# Altium project LacewingPXE_v3p1.PrjPcb
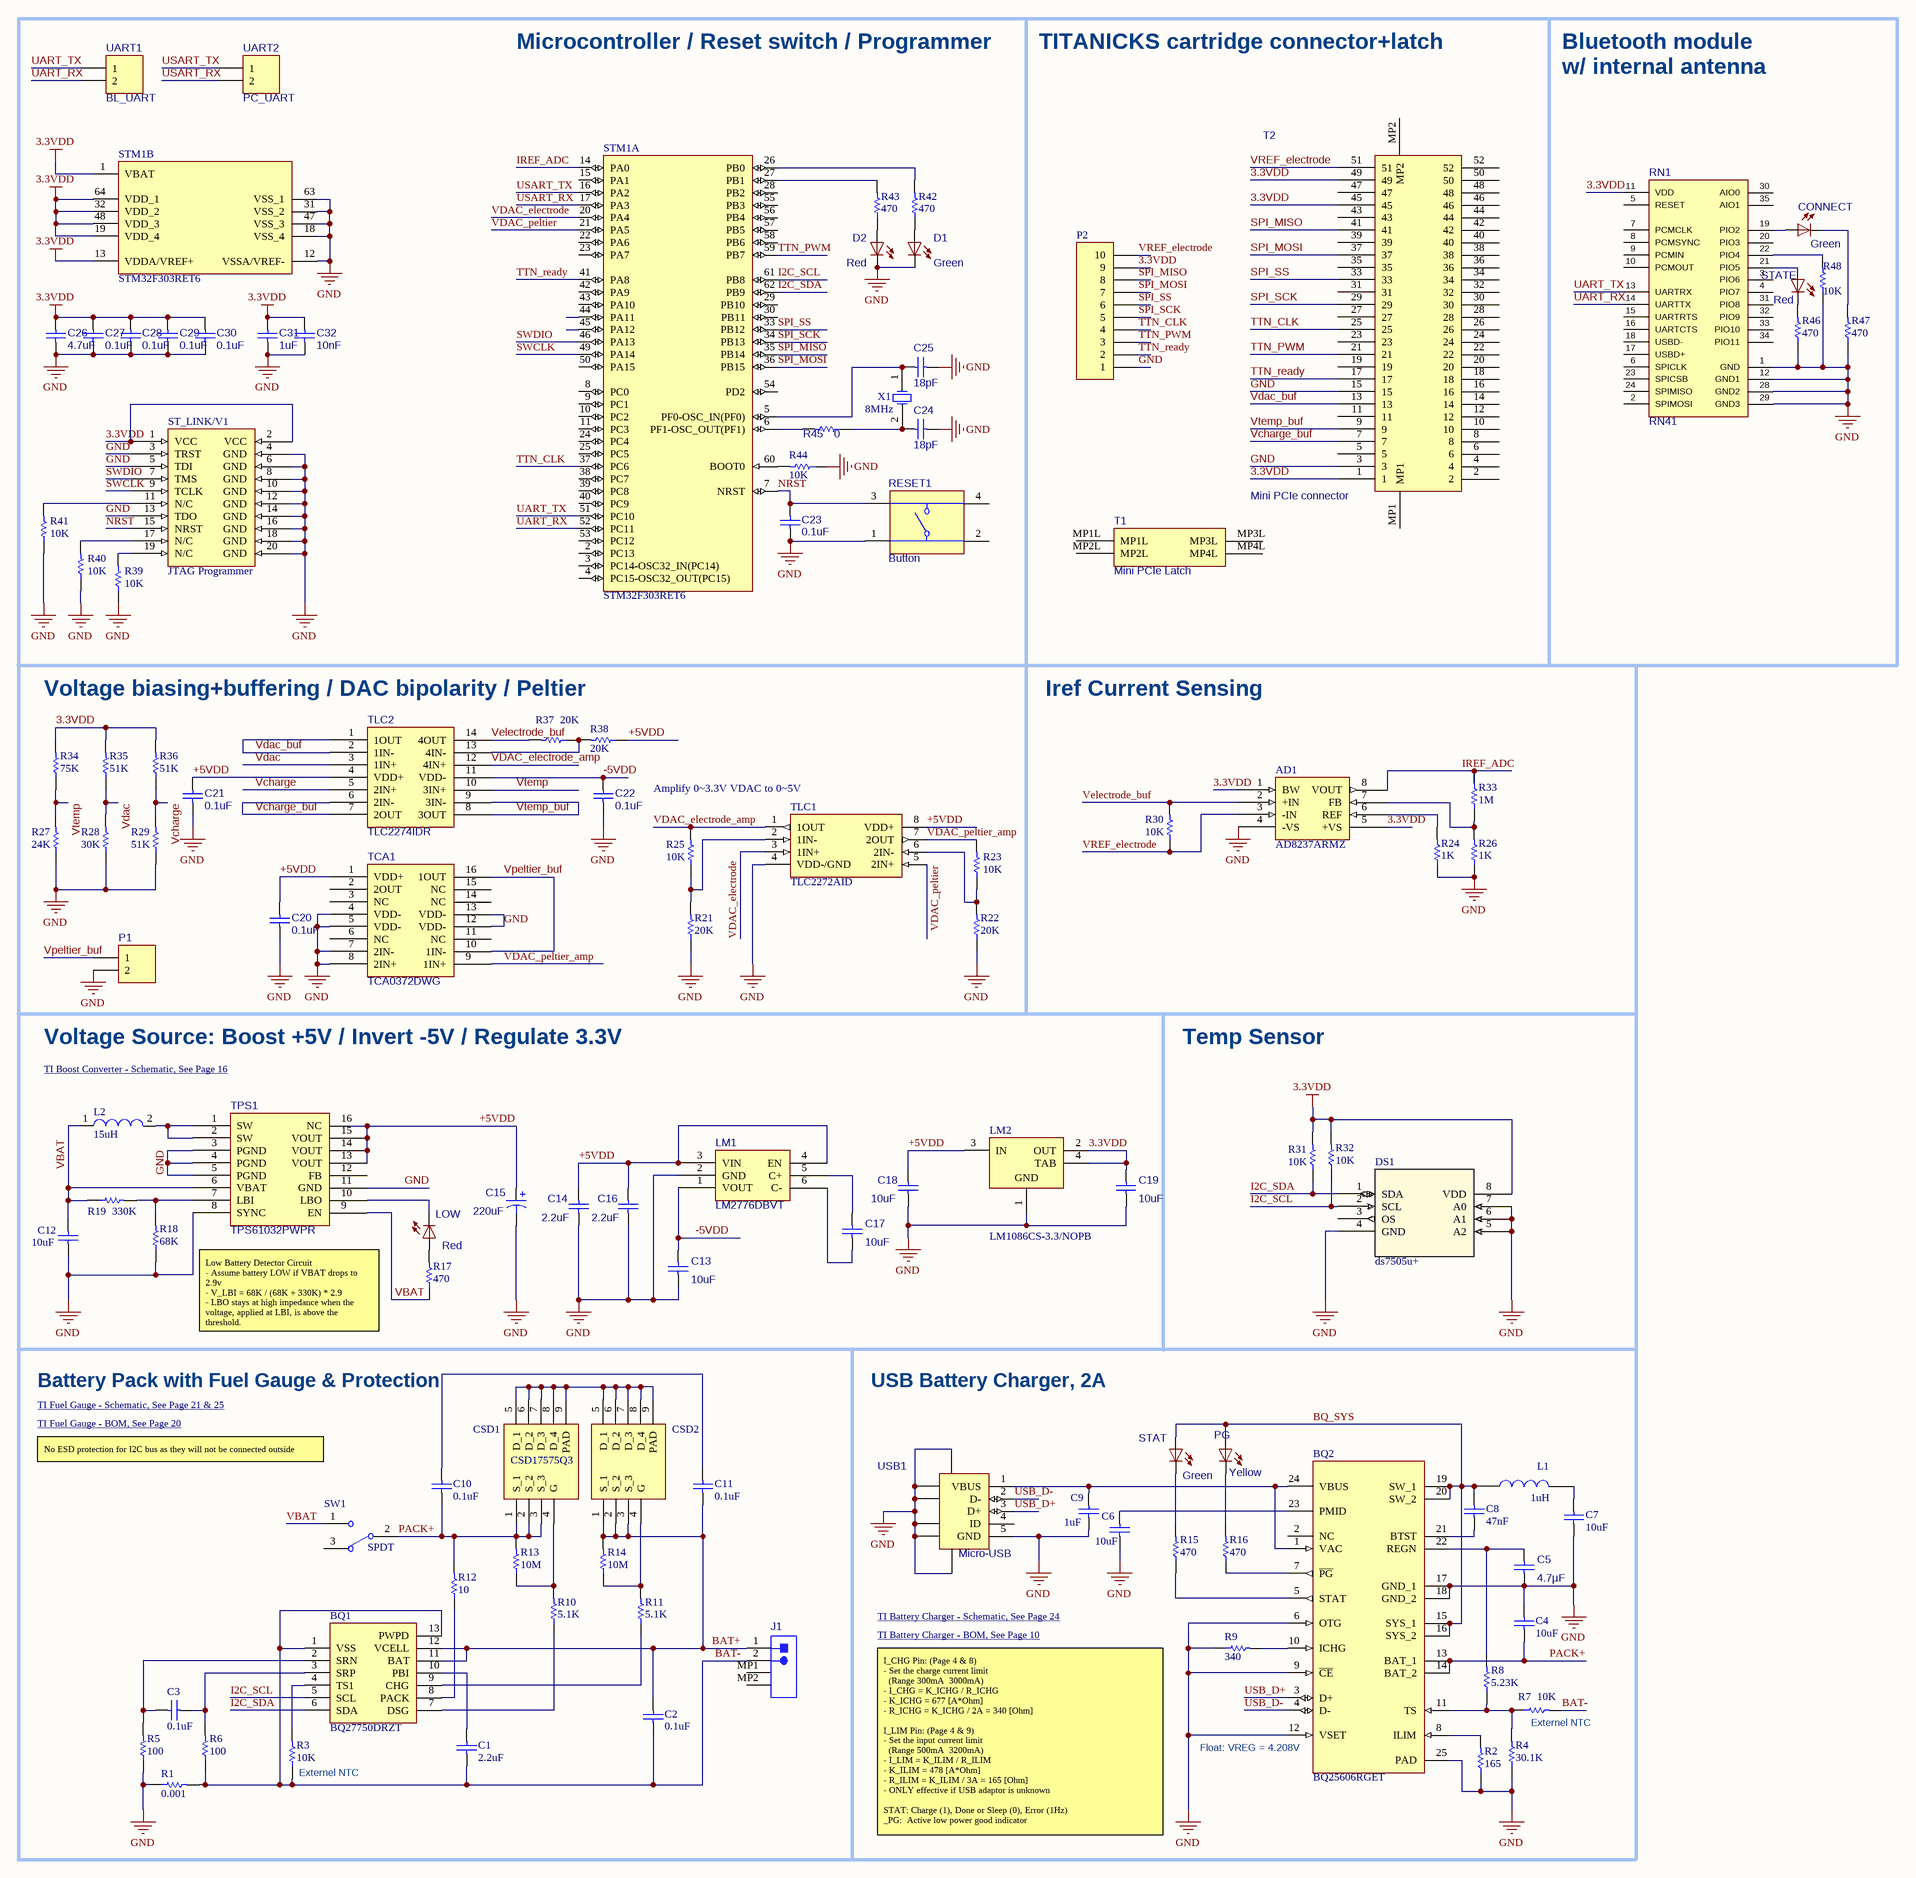
[diagram p0: LacewingPXE_v3p1.SchDoc]
1 sheet, 114 parts. Net scope: global (net labels, ports and power ports of the same name join across sheets).
Board file: LacewingPXE_v3p1.PcbDoc

## Sheet LacewingPXE_v3p1.SchDoc
size A2

### Parts
AD1  AD8237ARMZ  [ADI-RM-8_N]
BQ1  BQ27750DRZT  [BQ27510DRZT]
BQ2  BQ25606RGET  [QFN50P400X400X100-25N]
C1  2.2uF  [CAPC1005X55X25NL05T10]
C2  0.1uF  [CAPC1005X56X25LL10T15]
C3  0.1uF  [CAPC1005X56X25LL10T15]
C4  10uF  [CAPC2013X140X50ML20T25]
C5  4.7µF  [CAPC0603(1608)100_N]
C6  10uF  [CAPC2013X95X45NL10T25]
C7  10uF  [CAPC2013X140X50ML20T25]
C8  47nF  [CAPC1005X55X25NL05T10]
C9  1uF  [CAPC2013X95X45NL10T25]
C10  0.1uF  [CAPC1005X56X25LL10T15]
C11  0.1uF  [CAPC1005X56X25LL10T15]
C12  10uF  [CAPC2013X140X50NL20T25]
C13  10uF  [CAPC0805(2012)75_N]
C14  2.2uF  [CAPC0805(2012)75_N]
C15  220uF  [AVX-CAPC7343_V]
C16  2.2uF  [CAPC0805(2012)75_N]
C17  10uF  [CAPC0805(2012)75_N]
C18  10uF  [CAPC0805(2012)75_N]
C19  10uF  [CAPC0805(2012)75_N]
C20  0.1uF  [CAPC0603(1608)100_N]
C21  0.1uF  [CAPC0603(1608)100_N]
C22  0.1uF  [CAPC0603(1608)100_N]
C23  0.1uF  [CAPC0603(1608)100_N]
C24  18pF  [CAPC0603(1608)100_N]
C25  18pF  [CAPC0603(1608)100_N]
C26  4.7uF  [CAPC0603(1608)100_N]
C27  0.1uF  [CAPC0603(1608)100_N]
C28  0.1uF  [CAPC0603(1608)100_N]
C29  0.1uF  [CAPC0603(1608)100_N]
C30  0.1uF  [CAPC0603(1608)100_N]
C31  1uF  [CAPC0603(1608)100_N]
C32  10nF  [CAPC0603(1608)100_N]
CONNECT  Green  [LED-0603]
CSD1  CSD17575Q3  [CSD16327]
CSD2  CSD17575Q3  [CSD16327]  (value not drawn)
D1  Green  [LED-0603]
D2  Red  [LED-0603]
DS1  ds7505u+  [21-0036K]
J1  (no value)  [JST- S2B-PH-SM4-TB(LF)(SN)-2_V]
L1  1uH  [INDC2520X120N]
L2  15uH  [WE-PD 1050]
LM1  LM2776DBVT  [TI-DBV6_M]
LM2  LM1086CS-3.3/NOPB  [KTT0003B_N]
LOW  Red  [LED-0603]
P1  (no value)  [HDR1X2]
P2  (no value)  [HDR1X10]
PG  Yellow  [LED-0603]
R1  0.001  [RESC3216X89X104LL25T25]
R2  165  [RESC1005X40X25NL05T05]
R3  10K  [RESC1005X40X25LL05T05]
R4  30.1K  [RESC1005X40X25LL05T05]
R5  100  [RESC1005X40X25NL05T05]
R6  100  [RESC1005X40X25NL05T05]
R7  10K  [RESC1005X40X25LL05T05]
R8  5.23K  [RESC1005X40X25LL05T05]
R9  340  [RESC1005X40X25LL05T05]
R10  5.1K  [RESC0402(1005)_N]
R11  5.1K  [RESC0402(1005)_N]
R12  10  [RESC1005X40X25NL05T05]
R13  10M  [RESC1005X40X25LL05T05]
R14  10M  [RESC1005X40X25LL05T05]
R15  470  [RESC1005X40X25LL05T05]
R16  470  [RESC1005X40X25LL05T05]
R17  470  [RESC1005X40X25LL05T05]
R18  68K  [RESC1005X40X25ML05T05]
R19  330K  [RESC1005X40X25NL05T05]
R21  20K  [RESC1005X40X25NL05T05]
R22  20K  [RESC1005X40X25NL05T05]
R23  10K  [RESC1005X40X25NL05T05]
R24  1K  [RESC1005X40X25NL05T05]
R25  10K  [RESC1005X40X25NL05T05]
R26  1K  [RESC1005X40X25NL05T05]
R27  24K  [RESC1005X40X25ML05T05]
R28  30K  [RESC1005X40X25LL05T05]
R29  51K  [RESC1005X40X25ML05T05]
R30  10K  [RESC1005X40X25NL05T05]
R31  10K  [RESC1005X40X25NL05T05]
R32  10K  [RESC1005X40X25NL05T05]
R33  1M  [RESC1005X40X25NL05T05]
R34  75K  [RESC1005X40X25LL05T05]
R35  51K  [RESC1005X40X25ML05T05]
R36  51K  [RESC1005X40X25ML05T05]
R37  20K  [RESC1005X40X25NL05T05]
R38  20K  [RESC1005X40X25NL05T05]
R39  10K  [RESC1005X40X25NL05T05]
R40  10K  [RESC1005X40X25NL05T05]
R41  10K  [RESC1005X40X25NL05T05]
R42  470  [RESC1005X40X25LL05T05]
R43  470  [RESC1005X40X25LL05T05]
R44  10K  [RESC1005X40X25NL05T05]
R45  0  [RESC0603(1608)_N]
R46  470  [RESC1005X40X25LL05T05]
R47  470  [RESC1005X40X25LL05T05]
R48  10K  [RESC1005X40X25NL05T05]
RESET1  Button  [OMRON-B3F-1000-4_V]
RN1  RN41  [RN41]
ST_LINK/V1  JTAG Programmer  [JTAG2]
STAT  Green  [LED-0603]
STATE  Red  [LED-0603]
STM1  STM32F303RET6  [STM-LQFP64_V]  (parts A,B of 2)
SW1  SPDT  [1000-SERIES(SPDT)]
T1  Mini PCIe Latch  [Molex Latch-48099]
T2  Mini PCIe connector  [Molex Conn-67910]
TCA1  TCA0372DWG  [ONSC-SOIC-16-751G-03_V]
TLC1  TLC2272AID  [SOIC127P600X175-8N]
TLC2  TLC2274IDR  [TI-D14_M]
TPS1  TPS61032PWPR  [PW0016A_M]
UART1  BL_UART  [HDR1X2]
UART2  PC_UART  [HDR1X2]
USB1  Micro-USB  [HIRO-ZX62R-B-5P_V]
X1  8MHz  [QCL]

### Blocks framed on the sheet
Microcontroller / Reset switch / Programmer: C23-C32 D1 D2 R39-R45 RESET1 ST_LINK/V1 STM1 UART1 UART2 X1
TITANICKS cartridge connector+latch: P2 T1 T2
Voltage biasing+buffering / DAC bipolarity / Peltier: C20-C22 P1 R21-R23 R25 R27-R29 R34-R38 TCA1 TLC1 TLC2
Iref Current Sensing: AD1 R24 R26 R30 R33
Voltage Source: Boost +5V / Invert -5V / Regulate 3.3V: C12-C19 L2 LM1 LM2 LOW R17-R19 TPS1
Temp Sensor: DS1 R31 R32
Battery Pack with Fuel Gauge & Protection: BQ1 C1-C3 C10 C11 CSD1 CSD2 J1 R1 R3 R5 R6 R10-R14 SW1
USB Battery Charger, 2A: BQ2 C4-C9 L1 PG R2 R4 R7-R9 R15 R16 STAT USB1

### Nets
3.3VDD: AD1.1(BW) AD1.5(+VS) C19.1 C26.1 C27.1 C28.1 C29.1 C30.1 C31.1 C32.1 DS1.8(VDD) LM2.2(OUT) LM2.4(TAB) P2.9 R31.2 R32.2 R34.2 R35.2 R36.2 RN1.11(VDD) ST_LINK/V1.1(VCC) ST_LINK/V1.2(VCC) STM1.1(VBAT) STM1.13(VDDA/VREF+) STM1.19(VDD_4) STM1.32(VDD_2) STM1.48(VDD_3) STM1.64(VDD_1) T2.1 T2.45 T2.49
GND: AD1.4(-VS) BQ2.6(OTG) BQ2.9(~{CE}) BQ2.12(VSET) BQ2.17(GND_1) BQ2.18(GND_2) BQ2.25(PAD) C4.2 C5.1 C6.1 C7.1 C9.1 C12.1 C13.2 C14.1 C15.2 C16.1 C18.2 C19.2 C20.2 C21.2 C22.2 C23.2 C24.2 C25.2 C26.2 C27.2 C28.2 C29.2 C30.2 C31.2 C32.2 D1.C D2.C DS1.4(GND) DS1.5(A2) DS1.6(A1) DS1.7(A0) LM1.2(GND) LM2.1(GND) P1.2 P2.1 R1.1 R2.1 R4.1 R5.1 R9.1 R18.1 R21.1 R22.1 R24.1 R26.1 R27.1 R28.1 R29.1 R39.1 R40.1 R41.1 R44.1 R46.1 R47.1 R48.1 RESET1.1 RN1.1(GND) RN1.12(GND1) RN1.28(GND2) RN1.29(GND3) ST_LINK/V1.3(TRST) ST_LINK/V1.4(GND) ST_LINK/V1.5(TDI) ST_LINK/V1.6(GND) ST_LINK/V1.8(GND) ST_LINK/V1.10(GND) ST_LINK/V1.12(GND) ST_LINK/V1.13(TDO) ST_LINK/V1.14(GND) ST_LINK/V1.16(GND) ST_LINK/V1.18(GND) ST_LINK/V1.20(GND) STM1.12(VSSA/VREF-) STM1.18(VSS_4) STM1.31(VSS_2) STM1.47(VSS_3) STM1.63(VSS_1) T2.3 T2.15 TCA1.4(VDD-) TCA1.5(VDD-) TCA1.7(2IN-) TCA1.8(2IN+) TCA1.12(VDD-) TCA1.13(VDD-) TLC1.4(VDD-/GND) TPS1.3(PGND) TPS1.4(PGND) TPS1.5(PGND) TPS1.8(SYNC) TPS1.11(GND) USB1.5(GND) USB1.6(SHLD) USB1.7(SHLD) USB1.8(SHLD) USB1.9(SHLD) USB1.10(SHLD) USB1.11(SHLD)
+5VDD: C14.2 C15.1 C16.2 C18.1 C20.1 C21.1 LM1.3(VIN) LM1.4(EN) LM2.3(IN) R38.1 TCA1.1(VDD+) TLC1.8(VDD+) TLC2.4(VDD+) TPS1.13(VOUT) TPS1.14(VOUT) TPS1.15(VOUT) TPS1.16(NC)
-5VDD: C13.1 C22.1 LM1.1(VOUT) TLC2.11(VDD-)
BAT+: BQ1.11(BAT) BQ1.12(VCELL) C2.2 C11.1 CSD2.1(S_1) CSD2.2(S_2) CSD2.3(S_3) J1.1 R14.2
BAT-: BQ1.1(VSS) BQ1.13(PWPD) C1.1 C2.1 J1.2 R1.2 R3.1 R6.1 R7.2
BQ_SYS: BQ2.15(SYS_1) BQ2.16(SYS_2) BQ2.19(SW_1) BQ2.20(SW_2) C8.2 L1.1 PG.A STAT.A
I2C_SCL: BQ1.5(SCL) DS1.2(SCL) R32.1 STM1.61(PB8)
I2C_SDA: BQ1.6(SDA) DS1.1(SDA) R31.1 STM1.62(PB9)
IREF_ADC: AD1.8(VOUT) R33.2 STM1.14(PA0)
NRST: C23.1 RESET1.3 ST_LINK/V1.15(NRST) STM1.7(NRST)
PACK+: BQ2.13(BAT_1) BQ2.14(BAT_2) C4.1 C10.1 CSD1.1(S_1) CSD1.2(S_2) CSD1.3(S_3) R12.2 R13.2 SW1.2
SPI_MISO: P2.8 STM1.35(PB14) T2.41
SPI_MOSI: P2.7 STM1.36(PB15) T2.37
SPI_SCK: P2.5 STM1.34(PB13) T2.29
SPI_SS: P2.6 STM1.33(PB12) T2.33
SWCLK: ST_LINK/V1.9(TCLK) STM1.49(PA14)
SWDIO: ST_LINK/V1.7(TMS) STM1.46(PA13)
TTN_CLK: P2.4 STM1.37(PC6) T2.25
TTN_PWM: P2.3 STM1.59(PB7) T2.21
TTN_ready: P2.2 STM1.41(PA8) T2.17
UART_RX: RN1.14(UARTTX) STM1.52(PC11) UART1.2
UART_TX: RN1.13(UARTRX) STM1.51(PC10) UART1.1
USART_RX: STM1.17(PA3) UART2.2
USART_TX: STM1.16(PA2) UART2.1
USB_D+: BQ2.3(D+) USB1.3(D+)
USB_D-: BQ2.4(D-) USB1.2(D-)
VBAT: C12.2 L2.1 R17.1 R19.1 SW1.1 TPS1.6(VBAT) TPS1.9(EN)
Vcharge: R29.2 R36.1 TLC2.5(2IN+)
Vcharge_buf: T2.7 TLC2.6(2IN-) TLC2.7(2OUT)
Vdac: R28.2 R35.1 TLC2.3(1IN+)
Vdac_buf: T2.13 TLC2.1(1OUT) TLC2.2(1IN-)
VDAC_electrode: STM1.20(PA4) TLC1.3(1IN+)
VDAC_electrode_amp: R25.2 TLC1.1(1OUT) TLC2.12(4IN+)
VDAC_peltier: STM1.21(PA5) TLC1.5(2IN+)
VDAC_peltier_amp: R23.2 TCA1.9(1IN+) TLC1.7(2OUT)
Velectrode_buf: AD1.2(+IN) R30.2 R37.2 TLC2.14(4OUT)
Vpeltier_buf: P1.1 TCA1.10(1IN-) TCA1.16(1OUT)
VREF_electrode: AD1.3(-IN) P2.10 R30.1 T2.51
Vtemp: R27.2 R34.1 TLC2.10(3IN+)
Vtemp_buf: T2.9 TLC2.8(3OUT) TLC2.9(3IN-)
NetAD1_6: AD1.6(REF) R24.2
NetAD1_7: AD1.7(FB) R26.2 R33.1
NetBQ1_2: BQ1.2(SRN) C3.1 R5.2
NetBQ1_3: BQ1.3(SRP) C3.2 R6.2
NetBQ1_4: BQ1.4(TS1) R3.2
NetBQ1_7: BQ1.7(DSG) R10.1
NetBQ1_8: BQ1.8(PACK) R12.1
NetBQ1_9: BQ1.9(CHG) R11.1
NetBQ1_10: BQ1.10(PBI) C1.2
NetBQ2_1: BQ2.1(VAC) BQ2.24(VBUS) C9.2 USB1.1(VBUS)
NetBQ2_5: BQ2.5(STAT) R15.1
NetBQ2_7: BQ2.7(~{PG}) R16.1
NetBQ2_8: BQ2.8(ILIM) R2.2
NetBQ2_10: BQ2.10(ICHG) R9.2
NetBQ2_11: BQ2.11(TS) R4.2 R7.1 R8.1
NetBQ2_21: BQ2.21(BTST) C8.1
NetBQ2_22: BQ2.22(REGN) C5.2 R8.2
NetBQ2_23: BQ2.23(PMID) C6.2
NetC7_2: C7.2 L1.2
NetC10_2: C10.2 C11.2
NetC17_1: C17.1 LM1.5(C+)
NetC17_2: C17.2 LM1.6(C-)
NetC24_1: C24.1 R45.1 X1.2(OSC2)
NetC25_1: C25.1 STM1.5(PF0-OSC_IN(PF0)) X1.1(OSC1)
NetCONNECT_A: CONNECT.A RN1.19(PIO2)
NetCONNECT_C: CONNECT.C R47.2
NetCSD1_4: CSD1.4(G) R10.2 R13.1
NetCSD1_5: CSD1.5(D_1) CSD1.6(D_2) CSD1.7(D_3) CSD1.8(D_4) CSD1.9(PAD) CSD2.5(D_1) CSD2.6(D_2) CSD2.7(D_3) CSD2.8(D_4) CSD2.9(PAD)
NetCSD2_4: CSD2.4(G) R11.2 R14.1
NetD1_A: D1.A R42.1
NetD2_A: D2.A R43.1
NetL2_2: L2.2 TPS1.1(SW) TPS1.2(SW)
NetLOW_A: LOW.A R17.2
NetLOW_C: LOW.C TPS1.10(LBO)
NetPG_C: PG.C R16.2
NetR15_2: R15.2 STAT.C
NetR18_2: R18.2 R19.2 TPS1.7(LBI)
NetR21_2: R21.2 R25.1 TLC1.2(1IN-)
NetR22_2: R22.2 R23.1 TLC1.6(2IN-)
NetR37_1: R37.1 R38.2 TLC2.13(4IN-)
NetR39_2: R39.2 ST_LINK/V1.19(N/C)
NetR40_2: R40.2 ST_LINK/V1.17(N/C)
NetR41_2: R41.2 ST_LINK/V1.11(N/C)
NetR42_2: R42.2 STM1.26(PB0)
NetR43_2: R43.2 STM1.27(PB1)
NetR44_2: R44.2 STM1.60(BOOT0)
NetR45_2: R45.2 STM1.6(PF1-OSC_OUT(PF1))
NetR46_2: R46.2 STATE.C
NetR48_2: R48.2 RN1.22(PIO4)
NetRN1_21: RN1.21(PIO5) STATE.A

Not connected (* = marked no-connect by the designer): BQ2 2(NC); DS1 3(OS); J1 MP1 MP2; RESET1 2 4; RN1 2(SPIMOSI) 3(PIO6) 4(PIO7) 5(RESET) 6(SPICLK) 7(PCMCLK) 8(PCMSYNC) 9(PCMIN) 10(PCMOUT) 15(UARTRTS) 16(UARTCTS) 17(USBD+) 18(USBD-) 20(PIO3) 23(SPICSB) 24(SPIMISO) 30(AIO0) 31(PIO8) 32(PIO9) 33(PIO10) 34(PIO11) 35(AIO1); STM1 2(PC13) 3(PC14-OSC32_IN(PC14)) 4(PC15-OSC32_OUT(PC15)) 8(PC0) 9(PC1) 10(PC2) 11(PC3) 15(PA1) 22(PA6) 23(PA7) 24(PC4) 25(PC5) 28(PB2) 29(PB10) 30(PB11) 38(PC7) 39(PC8) 40(PC9) 42(PA9) 43(PA10) 44(PA11) 45(PA12) 50(PA15) 53(PC12) 54(PD2) 55(PB3) 56(PB4) 57(PB5) 58(PB6); SW1 3; T1 MP1L MP2L MP3L MP4L; T2 2 4 5 6 8 10 11 12 14 16 18 19 20 22 23 24 26 27 28 30 31 32 34 35 36 38 39 40 42 43 44 46 47 48 50 52 MP1 MP2; TCA1 2(2OUT) 3(NC) 6(NC) 11(NC) 14(NC) 15(NC); TPS1 12(FB); USB1 4(ID)

### Notes on the sheet
- Bluetooth module
- w/ internal antenna
- Amplify 0~3.3V VDAC to 0~5V
- TI Boost Converter - Schematic, See Page 16 <http://www.ti.com/lit/ds/symlink/tps61032.pdf>
- Low Battery Detector Circuit
  - Assume battery LOW if VBAT drops to 2.9v
  - V_LBI = 68K / (68K + 330K) * 2.9
  - LBO stays at high impedance when the voltage, applied at LBI, is above the threshold.
  It is active low when the voltage at LBI goes below 500 mV
- TI Fuel Gauge - Schematic, See Page 21 & 25 <http://www.ti.com/lit/ds/symlink/bq27750.pdf>
- TI Fuel Gauge - BOM, See Page 20 <http://www.ti.com/lit/ug/sluubp4/sluubp4.pdf>
- No ESD protection for I2C bus as they will not be connected outside
- TI Battery Charger - Schematic, See Page 24 <http://www.ti.com/lit/ds/symlink/bq25606.pdf>
- TI Battery Charger - BOM, See Page 10 <http://www.ti.com/lit/ug/sluubl3a/sluubl3a.pdf>
- (near R7) Externel NTC
- (near R3) Externel NTC
- (near BQ2) Float: VREG = 4.208V
- I_CHG Pin: (Page 4 & 8)
  - Set the charge current limit
  (Range 300mA  3000mA)
  - I_CHG = K_ICHG / R_ICHG
  - K_ICHG = 677 [A*Ohm]
  - R_ICHG = K_ICHG / 2A = 340 [Ohm]
  I_LIM Pin: (Page 4 & 9)
  - Set the input current limit
  (Range 500mA  3200mA)
  - I_LIM = K_ILIM / R_ILIM
  - K_ILIM = 478 [A*Ohm]
  - R_ILIM = K_ILIM / 3A = 165 [Ohm]
  - ONLY effective if USB adaptor is unknown
  STAT: Charge (1), Done or Sleep (0), Error (1Hz)
  _PG:  Active low power good indicator

### Library data of the parts
AD1 = AD8237: Instrument Amplifier; Manufacturer: ANALOG DEVICES; Part No: AD8237ARMZ; Farnell Order Code: 2213571
BQ1 = BQ27750DRZT: Fuel Gauge and Protection; Manufacturer: TEXAS INSTRUMENTS; Part No: BQ27750DRZT; Farnell Order Code: 2773561
BQ2 = BQ25606RGET: Battery Charger; Manufacturer: TEXAS INSTRUMENTS; Part No: BQ25606RGET; Farnell Order Code: 3008740
C1 = CMP-2008-04630-4: CAP 0402; Manufacturer: MURATA; Part No: GRM155R60J225ME15D; Farnell Order Code: 2362088
C2 C3 C10 C11 = CMP-2008-02743-1: CAP 0402; Manufacturer: AVX; Part No: 04026D104KAT2A; Farnell Order Code: 1327657
C4 C7 = CMP-2007-04702-1: CAP 0805; Manufacturer: AVX; Part No: 0805ZC106KAT2A; Farnell Order Code: 2094042
C5 = CAP: CAP 0603; Manufacturer: MURATA; Part No: GRM188R61C475KAAJD; Farnell Order Code: 2611924
C6 = CMP-2007-00191-1: CAP 0805; Manufacturer: MURATA; Part No: GRM21BC71E106KE11L; Farnell Order Code: 2611935
C8 = CMP-2008-04630-4: CAP 0402; Manufacturer: AVX; Part No: 0402YD473KAT2A; Farnell Order Code: 2332545
C9 = CMP-2007-00191-1: CAP 0805; Manufacturer: AVX; Part No: 08053C105JAT2A; Farnell Order Code: 2332736
C12 = CMP-2007-04643-1: CAP 0805; Manufacturer: AVX; Part No: 08056D106KAT2A; Farnell Order Code: 1301818
C13 C17-C19 = CMP-1036-00002-1: CAP 0805; Manufacturer: WURTH ELEKTRONIK; Part No: 885012107010; Farnell Order Code: 2533951
C14 C16 = CMP-1036-00002-1: CAP 0805; Manufacturer: MULTICOMP; Part No: MC0805B225K250CT; Farnell Order Code: 2320829
C15 = CMP-0279-00002-1: CAP 2917; Manufacturer: AVX; Part No: TAJD227K010RNJ; Farnell Order Code: 197191
C20-C23 C27-C30 = CMP-1035-00032-1: CAP 0603; Manufacturer: MULTICOMP; Part No: MC0603B104K500CT; Farnell Order Code: 1759122
C24 C25 = CMP-1035-00032-1: CAP 0603; Manufacturer: KEMET; Part No: C0603C180K5RACTU; Farnell Order Code: 2821151
C26 = CMP-1035-00032-1: CAP 0603; Manufacturer: AVX; Part No: 06036D475KAT2A; Farnell Order Code: 1833803
C31 = CMP-1035-00032-1: CAP 0603; Manufacturer: AVX; Part No: 06033D105KAT2A; Farnell Order Code: 1658868
C32 = CMP-1035-00032-1: CAP 0603; Manufacturer: KEMET; Part No: C0603C103K5RAC7081; Farnell Order Code: 2522596
CONNECT D1 STAT = LED0603: LED SMD 0603; Manufacturer: KINGBRIGHT; Part No: KPT-1608SGC; Farnell Order Code: 2099223
CSD1 CSD2 = CSD17575Q3: MOSFET; Manufacturer: TEXAS INSTRUMENTS; Part No: CSD17575Q3T; Farnell Order Code: 3009654
D2 LOW STATE = LED0603: LED SMD 0603; Manufacturer: KINGBRIGHT; Part No: KPT-1608SECK-J3; Farnell Order Code: 2335810
DS1 = ds7505u+: Digital Thermometer; Manufacturer: MAXIM; Part No: DS7505U+; Farnell Order Code: 2519297
J1 = CN-1P-2M-R2: Battery Connector; Manufacturer: JST; Part No: S2B-PH-SM4-TB(LF)(SN); Farnell Order Code: 9492615
L1 = DFE252012F-1R0M=P2: Inductor; Manufacturer: MURATA; Part No: DFE252012F-1R0M=P2; Farnell Order Code: 2871454
L2 = CMP-1396-00032-1: Power Inductor; Manufacturer: WURTH ELEKTRONIK; Part No: 7447714150; Farnell Order Code: 2082678
LM1 = LM2776: Voltage Inverter -5V; Manufacturer: TEXAS INSTRUMENTS; Part No: LM2776DBVT; Farnell Order Code: 2498456
LM2 = CMP-0062-00552-5: 1.5A 3.3V LDO; Manufacturer: TEXAS INSTRUMENTS; Part No: LM1086CS-3.3/NOPB; Farnell Order Code: 3121994
P1 UART1 UART2 = Header 2: Header, 2-Pin
  UART1 UART2: LatestRevisionDate: 17-Jul-2002; LatestRevisionNote: Re-released for DXP Platform.; Publisher: Altium Limited
P2 = Header 10: Header, 10-Pin
PG = LED0603: LED SMD 0603; Manufacturer: KINGBRIGHT; Part No: KPT-1608SYCK-J3; Farnell Order Code: 2335795
R1 = CMP-1666-00018-2: RES 1206; Manufacturer: VISHAY; Part No: WSLP12061L000FEA; Farnell Order Code: 2420760
R2 = CMP-2002-08233-1: RES 0402; Manufacturer: VISHAY; Part No: CRCW0402165RFKED; Farnell Order Code: 1150910
R3 R7 = CMP-2002-01179-1: Thermistor RES 0402; Manufacturer: PANASONIC; Part No: ERTJ0EG103FA; Farnell Order Code: 1892596
R4 = CMP-2002-08506-3: RES 0402; Manufacturer: VISHAY; Part No: CRCW040230K1FKED; Farnell Order Code: 1469704
R5 R6 = CMP-2002-08127-1: RES 0402; Manufacturer: VISHAY; Part No: CRCW0402100RFKED; Farnell Order Code: 1469672
R8 = CMP-2002-00118-3: RES 0402; Manufacturer: VISHAY; Part No: CRCW04025K23FKED; Farnell Order Code: 2140832
R9 = CMP-2002-00876-1: RES 0402; Manufacturer: PANASONIC; Part No: ERJ2RKF3400X; Farnell Order Code: 2302582
R10 R11 = CMP-1011-00590-1: RES 0402; Manufacturer: VISHAY; Part No: CRCW04025K10FKED; Farnell Order Code: 2140831
R12 = CMP-2002-08143-1: RES 0402; Manufacturer: VISHAY; Part No: CRCW040210R0FKED; Farnell Order Code: 1652742
R13 R14 = CMP-2002-08141-1: RES 0402; Manufacturer: VISHAY; Part No: CRCW040210M0FKED; Farnell Order Code: 1469670
R15-R17 R42 R43 R46 R47 = CMP-2002-00022-1: RES 0402; Manufacturer: VISHAY; Part No: CRCW0402470RFKED; Farnell Order Code: 2140742
R18 = CMP-2002-00170-1: RES 0402; Manufacturer: VISHAY; Part No: CRCW040268K0FKED; Farnell Order Code: 2140918
R19 = CMP-2002-08521-1: RES 0402; Manufacturer: VISHAY; Part No: CRCW0402330KFKED; Farnell Order Code: 2140980
R21 R22 R37 R38 = CMP-2002-08356-1: RES 0402; Manufacturer: VISHAY; Part No: CRCW040220K0FKED; Farnell Order Code: 1469693
R23 R25 R30-R32 R39-R41 R44 R48 = CMP-2002-08135-1: RES 0402; Manufacturer: VISHAY; Part No: CRCW040210K0FKED; Farnell Order Code: 1469669
R24 R26 = CMP-2002-08276-1: RES 0402; Manufacturer: VISHAY; Part No: CRCW04021K00FKED; Farnell Order Code: 1469662
R27 = CMP-2002-08403-1: RES 0402; Manufacturer: VISHAY; Part No: CRCW040224K0FKED; Farnell Order Code: 2140882
R28 = CMP-2002-08504-1: RES 0402; Manufacturer: VISHAY; Part No: CRCW040230K0FKED; Farnell Order Code: 2140891
R29 R35 R36 = CMP-2002-00078-1: RES 0402; Manufacturer: VISHAY; Part No: CRCW040251K0FKED; Farnell Order Code: 2140909
R33 = CMP-2002-08314-1: RES 0402; Manufacturer: VISHAY; Part No: CRCW04021M00FKED; Farnell Order Code: 1469667
R34 = CMP-2002-00208-1: RES 0402; Manufacturer: VISHAY; Part No: CRCW040275K0FKED; Farnell Order Code: 1469732
R45 = CMP-1012-00514-1: RES 0603; Manufacturer: MULTICOMP; Part No: MC0603SAF0000T5E; Farnell Order Code: 2309111
RESET1 = SW-SPST-4_A: Manufacturer: OMRON; Part No: B3F-1022; Farnell Order Code: 1829495
RN1 = BLUETOOTH-RN41: RN41 Bluetooth Module; Manufacturer: MICROCHIP; Part No: RN41-I/RM; Farnell Order Code: 2143311
ST_LINK/V1 = JTAG: Manufacturer: AMPHENOL; Part No: T821120A1S100CEU; Farnell Order Code: 2215309
STM1 = STM32F303RBT6_1: ARM Cortex-M4 32-bit MCU; Manufacturer: STMICROELECTRONICS; Part No: STM32F303RBT6; Farnell Order Code: 2333255
SW1 = 1101M1S3ZQE2: Manufacturer: C & K COMPONENTS; Part No: 1101M1S3ZQE2; Farnell Order Code: 1437714
T1 = Mini PCIe Latch: Manufacturer: MOLEX; Part No: 48099-5701; Mouser Order Code: 538-48099-5701
T2 = Mini PCIe connector: Manufacturer: MOLEX; Part No: 67910-5700; Mouser Order Code: 538-67910-5700
TCA1 = TCA0372: Dual High-Power OPAMP; Manufacturer: ON SEMICONDUCTOR; Part No: TCA0372DWG; Farnell Order Code: 1468783
TLC1 = TLC2272AID: Dual OPAMP; Manufacturer: TEXAS INSTRUMENTS; Part No: TLC2272AID; Farnell Order Code: 3005164
TLC2 = TLC2274: Quad OPAMP; Manufacturer: TEXAS INSTRUMENTS; Part No: TLC2274IDR; Farnell Order Code: 3117878
TPS1 = TPS61032: Voltage Boost +5V; Manufacturer: TEXAS INSTRUMENTS; Part No: TPS61032PWPR; Farnell Order Code: 1207333
USB1 = CMP-0031-00001-1: ZX62R-B-5P; Manufacturer: HIROSE; Part No: ZX62R-B-5P(30); Farnell Order Code: 2554983
X1 = XTAL: Crystal Oscillator; Manufacturer: QANTEK; Part No: QCL8.00000F18B23B; Farnell Order Code: 2508448